# Altium schematic sheet 7-GPS&GPRS.SCHDOC
size A4
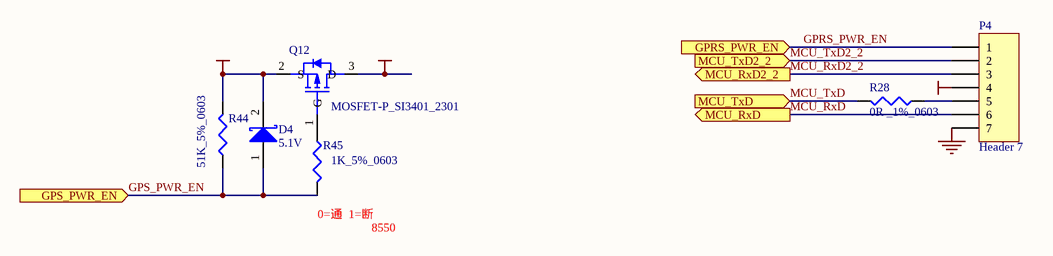
[diagram p0: 7-GPS&GPRS.SCHDOC]

## Parts
D4  5.1V  [LED0805]
P4  Header 7  [HDR1X7]
Q12  MOSFET-P_SI3401_2301  [SO-G3/C2.5]
R28  0R _1%_0603  [C1608-0603]
R44  51K_5%_0603  [C1608-0603]
R45  1K_5%_0603  [C1608-0603]

## Ports
GPRS_PWR_EN (in), GPS_PWR_EN (in), MCU_RxD2_2 (out), MCU_RxD (out), MCU_TxD2_2 (in), MCU_TxD (in)

## Nets
GND: P4.7
V_GPS: P4.4 Q12.3(D)
VCC_2V8: D4.2(K) Q12.2(S) R44.2
GPRS_PWR_EN: P4.1 ; port GPRS_PWR_EN
GPS_PWR_EN: D4.1(A) R44.1 R45.2 ; port GPS_PWR_EN
MCU_RxD: P4.6 ; port MCU_RxD
MCU_RxD2_2: P4.3 ; port MCU_RxD2_2
MCU_TxD: R28.2 ; port MCU_TxD
MCU_TxD2_2: P4.2 ; port MCU_TxD2_2
NetP4_5: P4.5 R28.1
NetQ12_1: Q12.1(G) R45.1

## Notes on the sheet
- (near R45) 0=通  1=断
- 8550

## Library data of the parts
D4 = D Schottky: Schottky Diode; Code - JEDEC: DO-214-AA; Published: 8-Jun-2000; Revision: July-2002: Re-released for DXP Platform.; Publisher: Altium Limited
P4 = Header 7: Header, 7-Pin; LatestRevisionDate: 17-Jul-2002; LatestRevisionNote: Re-released for DXP Platform.; Publisher: Altium Limited
Q12 = MOSFET-P
R28 = Res3: Resistor; Value: 1M %5 0603_NC; Published: 8-Jun-2000; Revision: July-2002: Re-released for DXP Platform.; Publisher: Altium Limited
R44 R45 = Res3: Resistor; Value: 1K%5 0603; Published: 8-Jun-2000; Revision: July-2002: Re-released for DXP Platform.; Publisher: Altium Limited